# EAGLE design FREZZbigV02 (EAGLE 7.5.0)
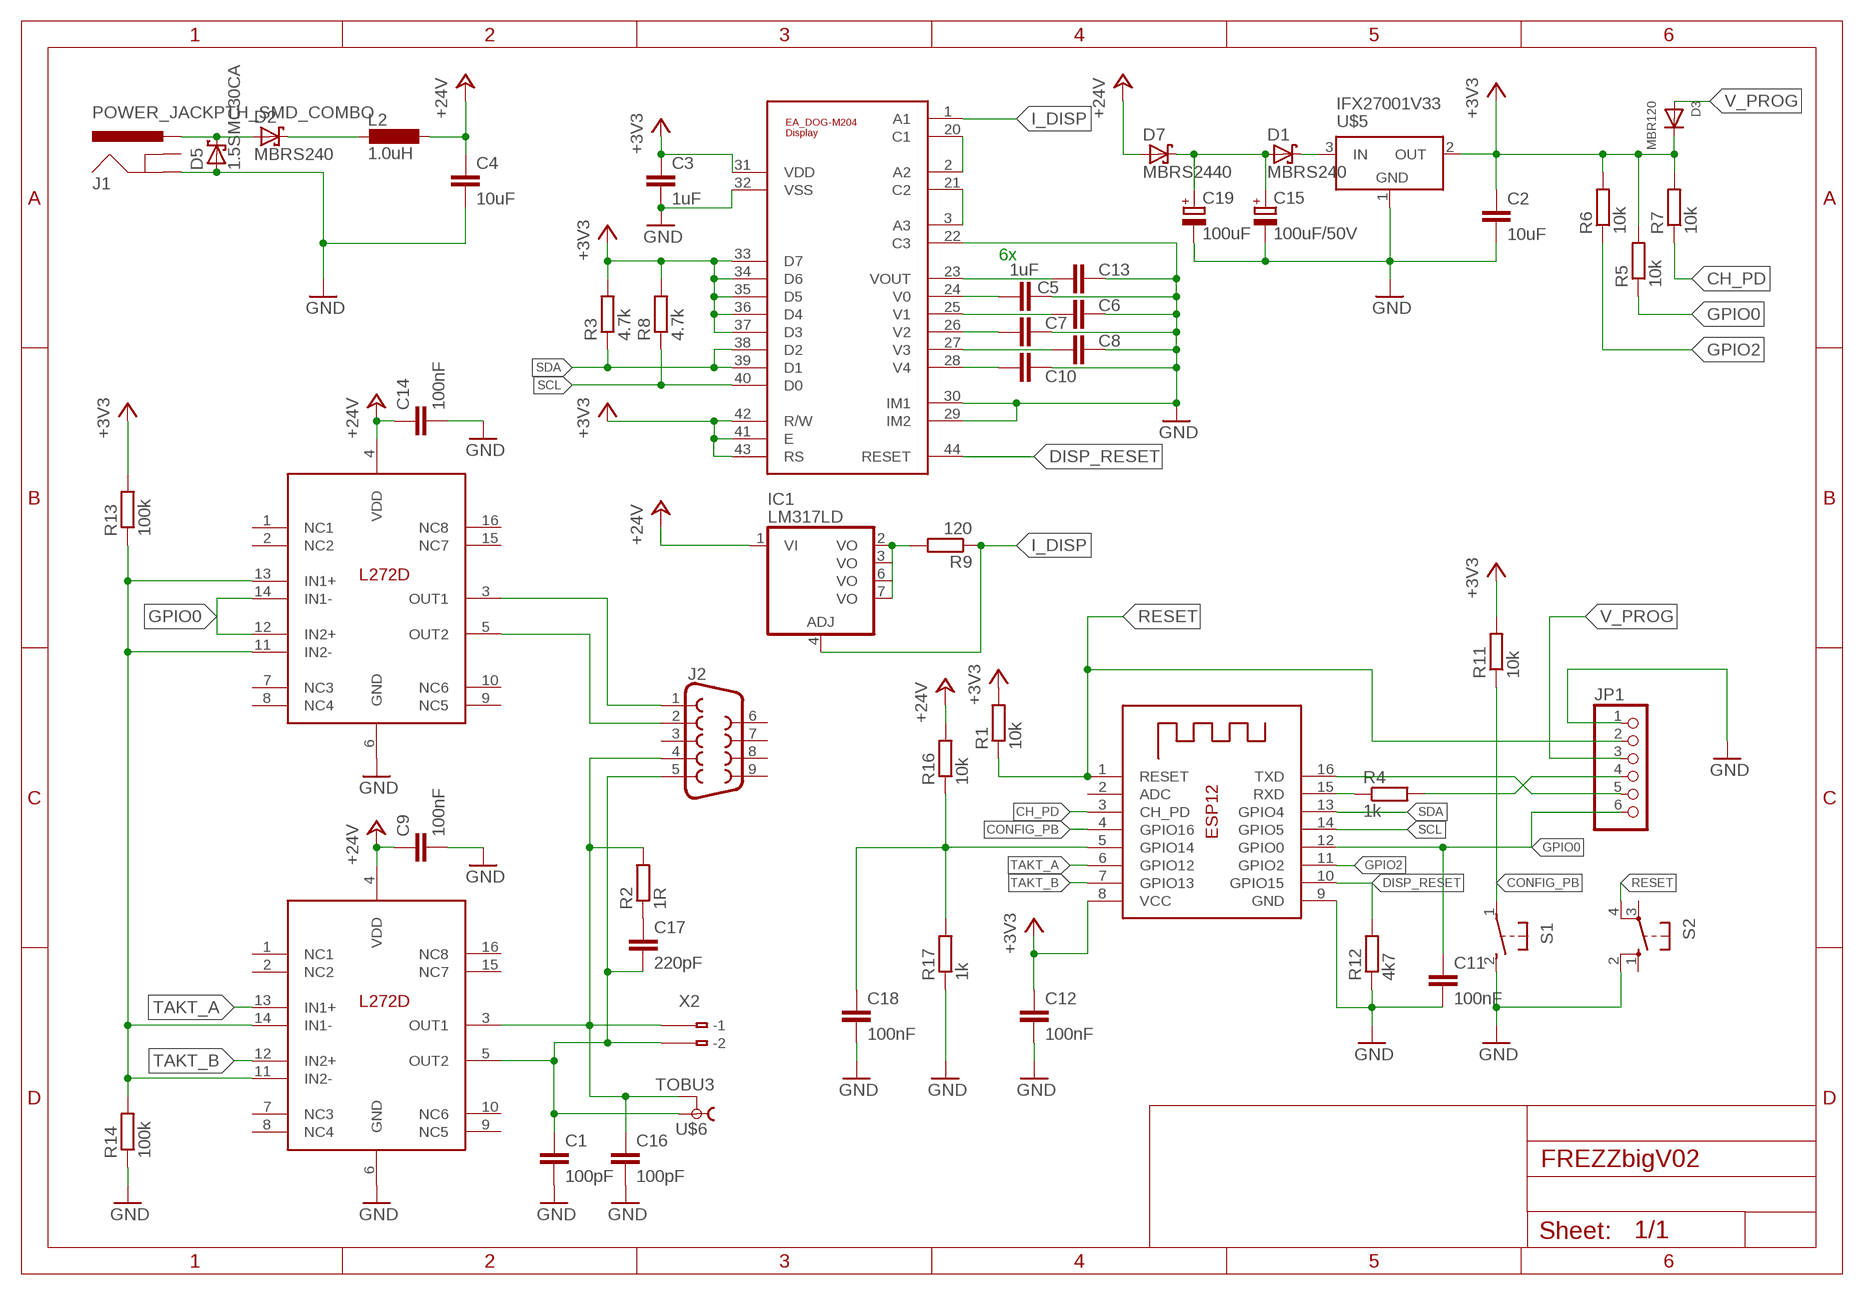
[diagram p0: schematic, sheet 1]

## Parts
C1  100pF  C-EUC0603K  [C0603K]
C2  10uF  C-EUC0603K  [C0603K]
C3  1uF  C-EUC0603K  [C0603K]
C4  10uF  C-EUC1210K  [C1210K]
C5  1uF  C-EUC0603K  [C0603K]
C6  1uF  C-EUC0603K  [C0603K]
C7  1uF  C-EUC0603K  [C0603K]
C8  1uF  C-EUC0603K  [C0603K]
C9  100nF  C-EUC0603K  [C0603K]
C10  1uF  C-EUC0603K  [C0603K]
C11  100nF  C-EUC0603K  [C0603K]
C12  100nF  C-EUC0603K  [C0603K]
C13  1uF  C-EUC0603K  [C0603K]
C14  100nF  C-EUC0603K  [C0603K]
C15  100uF/50V  CPOL-EUF  [PANASONIC_F]
C16  100pF  C-EUC0603K  [C0603K]
C17  220pF  C-EUC0603K  [C0603K]
C18  100nF  C-EUC0603K  [C0603K]
C19  100uF  CPOL-EUE7.5-18  [E7,5-18]
D1  MBRS240  SCHOTTKY-DIODESMD  [SMB]
D2  MBRS240  SCHOTTKY-DIODESMD  [SMB]
D3  MBR120  DIODESOD-123  [SOD-123]
D5  1.5SMC30CA  SCHOTTKY-DIODESMC  [SMC]
D7  MBRS2440  SCHOTTKY-DIODESMD  [SMB]
IC1  LM317LD  [SO08]
J1  POWER_JACKPTH_SMD_COMBO  [POWER_JACK_COMBO]
J2  DB9FEMALE  [DB9]
JP1  PINHD-1X6  [1X06]
L2  1.0uH  L-EUL3230M  [L3230M]
R1  10k  R-EU_M1206  [M1206]
R2  1R  R-EU_M1206  [M1206]
R3  4.7k  R-EU_M1206  [M1206]
R4  1k  R-EU_M1206  [M1206]
R5  10k  R-EU_M1206  [M1206]
R6  10k  R-EU_M1206  [M1206]
R7  10k  R-EU_M1206  [M1206]
R8  4.7k  R-EU_M1206  [M1206]
R9  120  R-EU_M1206  [M1206]
R11  10k  R-EU_M1206  [M1206]
R12  4k7  R-EU_M1206  [M1206]
R13  100k  R-EU_M1206  [M1206]
R14  100k  R-EU_M1206  [M1206]
R16  10k  R-EU_M1206  [M1206]
R17  1k  R-EU_M1206  [M1206]
S1  31-XX  [B3F-31XX]
S2  10-XX  [B3F-10XX]
U$1  EA_DOG-M204-DISPLAY  [E_DOG-M204_DISPLAY]
U$2  L272D  [SO16]
U$3  L272D  [SO16]
U$5  IFX27001V33  IFX27001  [TO252]
U$6  TOBU3  TOBU3-REICHELT  [TOBU3-REICHELT]
X1  ESP-12  [ESP-12]
X2  233-102  [233-102]

## Nets
$N122: D1.C U$5.3(IN)
+3V3 [Power]: C2.1 C3.1 C12.1 D3.C R1.2 R3.2 R5.2 R6.2 R7.2 R8.2 R11.2 R13.2 U$1.31(VDD) U$1.33(D7) U$1.34(D6) U$1.35(D5) U$1.36(D4) U$1.37(D3) U$1.41(E) U$1.42(R/W) U$1.43(RS) U$5.2(OUT) X1.8(VCC)
+24V [Power]: C4.1 C9.1 C14.1 D7.A IC1.1(VI) L2.1 R16.2 U$2.4(VDD) U$3.4(VDD)
CH_PD: R7.1 X1.3(CH_PD)
CONFIG_PB: R11.1 S1.1(P) X1.4(GPIO16)
DISP_RESET: R12.2 U$1.44(RESET) X1.10(GPIO15)
GND [Power]: C1.2 C2.2 C3.2 C4.2 C5.1 C6.1 C7.1 C8.1 C9.2 C10.1 C11.2 C12.2 C13.1 C14.2 C15.- C16.2 C18.2 C19.- D5.A J1.GND@1(GND) JP1.1 R12.1 R14.1 R17.1 S1.2(S) S2.2(S1) U$1.22(C3) U$1.29(IM2) U$1.30(IM1) U$1.32(VSS) U$2.6(GND) U$3.6(GND) U$5.1(GND) X1.9(GND)
GPIO0: C11.1 JP1.6 R5.1 U$3.12(IN2+) U$3.14(IN1-) X1.12(GPIO0)
GPIO2: R6.1 X1.11(GPIO2)
I_DISP: IC1.4(ADJ) R9.1 U$1.1(A1)
N$1: JP1.5 X1.16(TXD)
N$2: JP1.4 R4.2
N$3: R4.1 X1.15(RXD)
N$4: C13.2 U$1.23(VOUT)
N$5 [Power]: D2.A D5.C J1.POWER(PWR)
N$6: C5.2 U$1.24(V0)
N$7 [Power]: D2.C L2.2
N$8 [Power]: C15.+ C19.+ D1.A D7.C
N$9: C17.1 R2.1
N$11 [Power]: C16.1 J2.4 R2.2 U$2.3(OUT1) U$6.2 U$6.2@1 U$6.2@2 X2.B1(B-1)
N$12: C6.2 U$1.25(V1)
N$13 [Power]: C1.1 C17.2 J2.5 U$2.5(OUT2) U$6.1 X2.B2(B-2)
N$15: C7.2 U$1.26(V2)
N$16: C8.2 U$1.27(V3)
N$21: C10.2 U$1.28(V4)
N$22: U$1.3(A3) U$1.21(C2)
N$23: U$1.2(A2) U$1.20(C1)
N$24: IC1.2(VO) IC1.3(VO) IC1.6(VO) IC1.7(VO) R9.2
N$26 [Power]: J2.1 U$3.3(OUT1)
N$27 [Power]: J2.2 U$3.5(OUT2)
N$38: R13.1 R14.2 U$2.11(IN2-) U$2.14(IN1-) U$3.11(IN2-) U$3.13(IN1+)
RESET: JP1.2 R1.1 S2.4(P1) X1.1(RESET)
SCL: R8.1 U$1.40(D0) X1.14(GPIO5)
SDA: R3.1 U$1.38(D2) U$1.39(D1) X1.13(GPIO4)
SHDN: C18.1 R16.1 R17.2 X1.5(GPIO14)
TAKT_A: U$2.13(IN1+) X1.6(GPIO12)
TAKT_B: U$2.12(IN2+) X1.7(GPIO13)
V_PROG: D3.A JP1.3
Unconnected: J1.GND(GNDBREAK) J2.3 J2.6 J2.7 J2.8 J2.9 S2.1(S) S2.3(P) U$2.1(NC1) U$2.2(NC2) U$2.7(NC3) U$2.8(NC4) U$2.9(NC5) U$2.10(NC6) U$2.15(NC7) U$2.16(NC8) U$3.1(NC1) U$3.2(NC2) U$3.7(NC3) U$3.8(NC4) U$3.9(NC5) U$3.10(NC6) U$3.15(NC7) U$3.16(NC8) X1.2(ADC) X2.A1(-1) X2.A2(-2)

## Notes on the sheet
- 6x

## Library data of the parts
C1-C14 C16-C18 = rcl:C-EU: CAPACITOR, European symbol
C15 C19 = rcl:CPOL-EU: POLARIZED CAPACITOR, European symbol
D1 D2 D5 D7 = diode:SCHOTTKY-DIODE: Schottky Diode
D3 = adafruit:DIODE: Diode SMADIODE - SMA Surface Mount Package 20V 1A Schottky Diode Digikey: 641-1014-6-ND DO-1N4148 - Through Hole Small Current Diode SOD-123 20V 1 A (.5mV Vf) Schottky Diode - Digikey: MBRX120TPMSCT-ND SOD-323 10V 570mA (.38mV Vf, 3ns) Schottky Diode - Digikey: ZLLS410CT-ND SOD-523 30V 30mA Schottky Diode (RB751S-40TE61) - Digikey: RB751S-40TE61CT-ND SOT23-R/W - SOT23 Package (R = Solder Paste/Reflow Ovens, W = Hand-Soldering) BAT54Film 40V 300mA - Digikey: 497-7162-1-ND
IC1 = linear:LM317LD: LOW CURRENT 1.2 TO 37V ADJUSTABLE VOLTAGE REGULATOR Source: http://pdf.alldatasheet.com
J1 = SparkFun-Connectors:POWER_JACK: Power Jack Connector This is the standard 5.5mm barrel jack for power. The PTH is the most common, proven, reliable, footprint. The Slot footprint only works if the mill layer is transmitted to the PCB fab house so be warned. Here are the connectors we sell at SparkFun: DC Barrel Power Jack/Connector <https://www.sparkfun.com/products/119> (PRT-00119) DC Barrel Power Jack/Connector (SMD) <https://www.sparkfun.com/products/12748> (PRT-12748) DC Barrel Jack Adapter - Breadboard Compatible <https://www.sparkfun.com/products/10811> (PRT-10811) It is used on this SparkFun product (and many, many others): SparkFun RedBoard - Programmed with Arduino <https://www.sparkfun.com/products/12757> (DEV-12757) Also, if you need a mating power supply or connector, please check these out: Wall Adapter Power Supply - 9VDC 650mA <https://www.sparkfun.com/products/298> (TOL-00298) DC Barrel Jack Adapter - Male <https://www.sparkfun.com/products/10287> (PRT-10287)
J2 = SparkFun-Connectors:DB9: DB9 Connector Standard DB9 (D-Sub 9) serial connector. Can be used for CAN bus as well as RS485 and RS232. Footprint production proven. Here is the female version connector we sell at SparkFun: 9 Pin Female Serial Connector - PCB Mount <https://www.sparkfun.com/products/429> (PRT-00429) This connector has been used on the following SparkFun products: SparkFun RS232 Shifter - SMD <https://www.sparkfun.com/products/449> (PRT-00449) SparkFun RS232 Shifter SMD (No DB9) <https://www.sparkfun.com/products/8780> (PRT-08780); PROD_ID: CONN-08194
JP1 = adafruit:PINHD-1X6: PIN HEADER
L2 = rcl:L-EU: INDUCTOR, European symbol
R1-R9 R11-R14 R16 R17 = resistor:R-EU_: RESISTOR, European symbol
S1 = switch-omron:31-XX: OMRON SWITCH; MPN: B3F-3100; OC_FARNELL: 959704; OC_NEWARK: 36M3582
S2 = switch-omron:10-XX: OMRON SWITCH; MPN: B3F-1000; OC_FARNELL: 176432; OC_NEWARK: 36M3542
U$1 = display_ea_dog-m:EA_DOG-M204-DISPLAY
U$2 U$3 = adafruit:L272D
U$5 = MeineLIB:IFX27001
U$6 = con-hirschmann:TOBU3-REICHELT
X1 = adafruit:ESP-12
X2 = con-wago:233-102: WAGO Cage Clamp; MPN: 233-102; OC_FARNELL: unknown; OC_NEWARK: 28K9044

## Net classes
0 default: width 0.102 mm, drill 0.076 mm, clearance 0.051 mm
1 Power: width 1.016 mm, drill 0.076 mm, clearance 0.051 mm to class 0, clearance 0.051 mm
2 24V: width 0.127 mm, drill 0.076 mm, clearance 0.051 mm to class 0, clearance 0.051 mm to class 1, clearance 0.051 mm

## Board
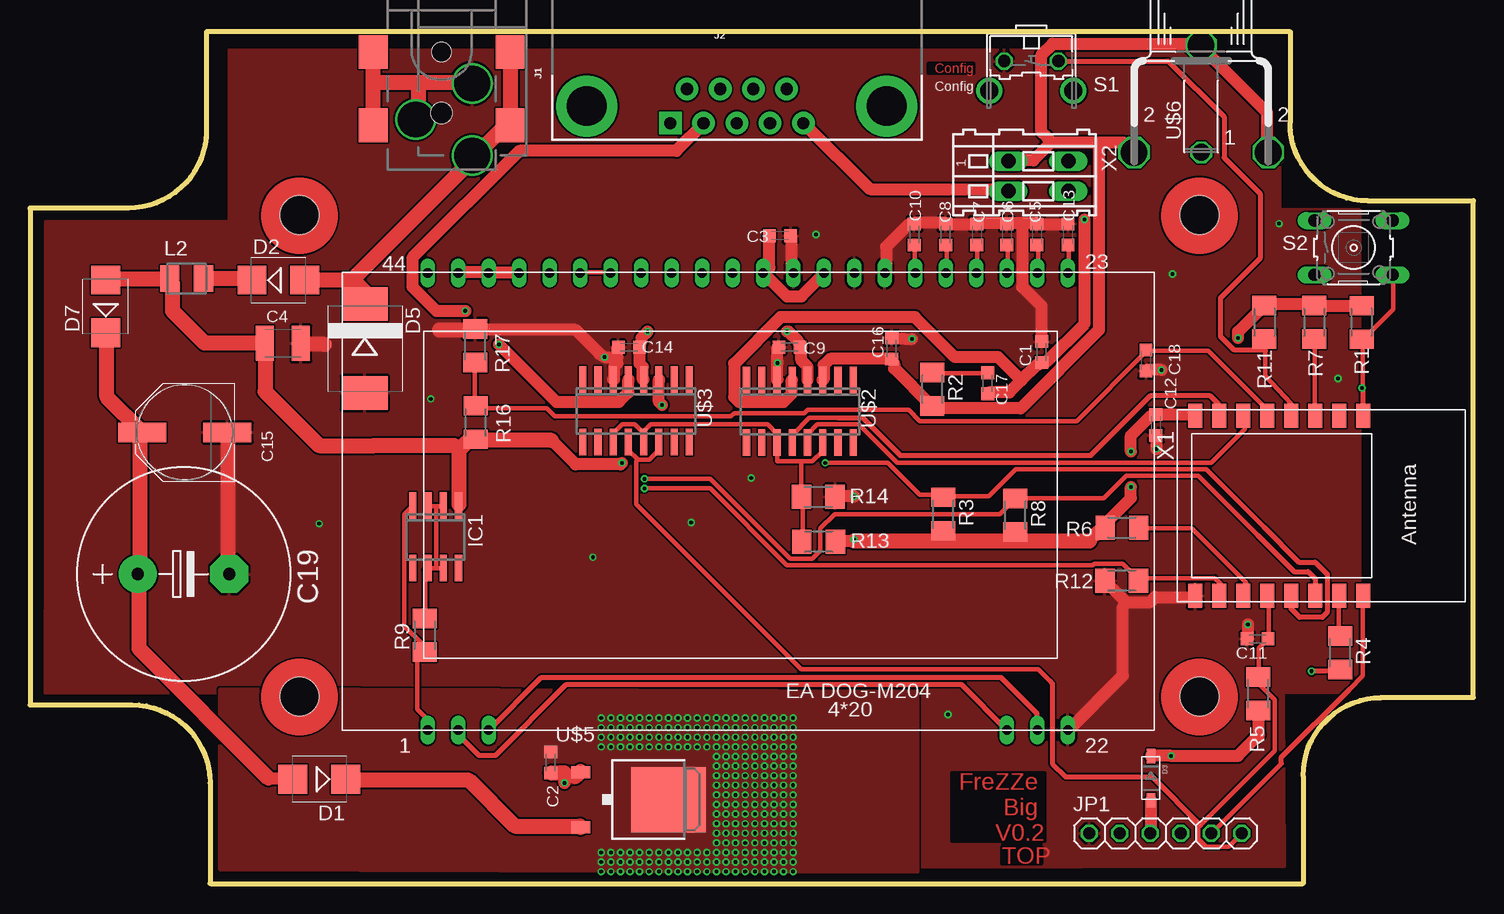
[diagram p1: board, top side]
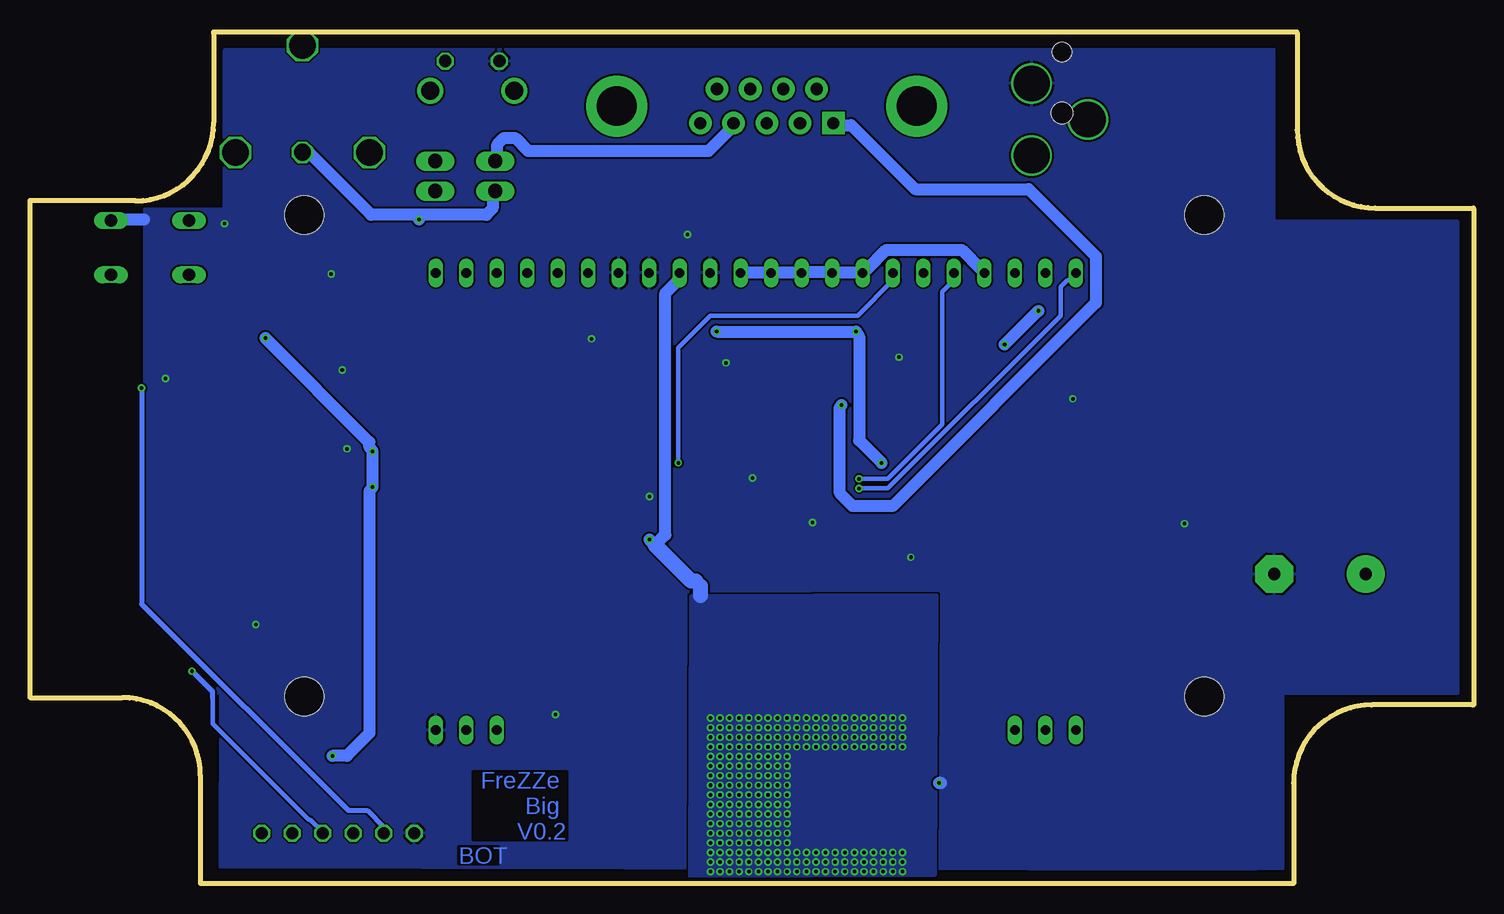
[diagram p2: board, bottom side, seen from below]

Size 120.3 x 70.98 mm. Coordinates in mm from the lower left corner, seen from the top.
Outline: 0,56.25 0,14.88
Outline: 15.05,0 106.08,0
Outline: 120.28,15.49 120.28,56.93
Outline: 105.02,70.98 14.7,70.98
Outline: 14.7,70.9 14.7,62.8 arc-90 8.2,56.3 0,56.3
Outline: 105,70.9 105,63.4 arc90 111.5,56.9 120.3,56.9
Outline: 120.3,15.5 112.6,15.5 arc90 106.1,9 106.1,0
Outline: 0.1,14.9 8.5,14.9 arc-90 15,8.4 15,0
Copper layers (1+16): Top 0.035mm / dielectric 0.36mm / Bottom 0.035mm
Design rules "PCB-Joker-Eagle-DRU-v1-0 3 *": minimum track width 15mil, minimum drill 0.3mm, track to track 6mil, track to pad 6mil, pad to pad 6mil, via to via 6mil, smd to smd 6mil, copper to edge 0mil, drill to drill 10mil, minimum pad ring 8mil, minimum via ring 6mil, stop-mask expansion 3mil, vias tented up to drill 0mil, thermal gap 8mil
Holes 3.2 mm at 97.45,15.61 97.45,55.71 22.45,55.71 22.45,15.61
tKeepout: area 112.4,22.4 to 120.1,40.6
bKeepout: area 112.4,22.4 to 120.1,40.6; area 96.2,14.3 to 98.7,16.8; area 96.2,54.4 to 98.7,56.9; area 21.2,54.4 to 23.7,56.9; area 21.2,14.3 to 23.7,16.8

### Footprints (pad centres in the part's own frame; a part is rotated, then mirrored left to right if it is on the bottom)
C0603K = smd 1.05 x 1.08: 1 -0.875,0; 2 0.875,0
C1210K = smd 1.5 x 2.9: 1 -1.5,0; 2 1.5,0
PANASONIC_F = smd 4 x 1.6: + 3.55,0; - -3.55,0
E7,5-18 = drill 1.016 pad 3.15: + -3.81,0 | drill 1.016 pad 3.15 octagon: - 3.81,0
SMB = smd 2.4 x 2.4: A 2.2,0; C -2.2,0
SOD-123 = smd 1.2 x 0.7: A 1.85,0; C -1.85,0
SMC = smd 2.8 x 3.8: A 3.7,0; C -3.7,0
SO08 = smd 0.6 x 2.2: 1 -1.905,-2.6; 2 -0.635,-2.6; 3 0.635,-2.6; 4 1.905,-2.6; 5 1.905,2.6; 6 0.635,2.6; 7 -0.635,2.6; 8 -1.905,2.6
POWER_JACK_COMBO = drill 2.997: GND 5.62,-2.16; GND@1 2.62,2.54; POWER 8.62,2.54 | smd 2.8 x 2.4: GND@3 0,-5.7; GND@4 6.1,-5.7; POWER@1 0,5.7; POWER@2 6.1,5.7 | hole 1.6: 0,0 | hole 1.8: 5.08,0
DB9 = drill 1.016 pad 1.88 square: 1 -5.54,-1.42 | drill 1.016 pad 1.88: 2 -2.77,-1.42; 3 0,-1.42; 4 2.77,-1.42; 5 5.54,-1.42; 6 -4.15,1.42; 7 -1.38,1.42; 8 1.38,1.42; 9 4.15,1.42 | drill 3.302 pad 5.08: G1 -12.5,0; G2 12.5,0
1X06 = drill 1.016 octagon: 1 -6.35,0; 2 -3.81,0; 3 -1.27,0; 4 1.27,0; 5 3.81,0; 6 6.35,0
L3230M = smd 1.6 x 2.2: 1 -1.4,0; 2 1.4,0
M1206 = smd 1.6 x 2: 1 -1.4,0; 2 1.4,0
B3F-31XX = drill 1.016 octagon: 1 -2.261,-1.245; 2 2.261,-1.245 | drill 1.499 pad 2.159: 3 -3.505,1.245; 4 3.505,1.245
B3F-10XX = drill 1.016 long: 1 -3.251,2.261; 2 3.251,2.261; 3 -3.251,-2.261; 4 3.251,-2.261
E_DOG-M204_DISPLAY = drill 0.8 long: 1 7.144,0; 2 9.684,0; 3 12.224,0; 20 55.404,0; 21 57.944,0; 22 60.484,0; 23 60.484,38.1; 24 57.944,38.1; 25 55.404,38.1; 26 52.864,38.1; 27 50.324,38.1; 28 47.784,38.1; 29 45.244,38.1; 30 42.704,38.1; 31 40.164,38.1; 32 37.624,38.1; 33 35.084,38.1; 34 32.544,38.1; 35 30.004,38.1; 36 27.464,38.1; 37 24.924,38.1; 38 22.384,38.1; 39 19.844,38.1; 40 17.304,38.1; 41 14.764,38.1; 42 12.224,38.1; 43 9.684,38.1; 44 7.144,38.1
SO16 = smd 0.6 x 2.2: 1 -4.445,-2.6; 2 -3.175,-2.6; 3 -1.905,-2.6; 4 -0.635,-2.6; 5 0.635,-2.6; 6 1.905,-2.6; 7 3.175,-2.6; 8 4.445,-2.6; 9 4.445,2.6; 10 3.175,2.6; 11 1.905,2.6; 12 0.635,2.6; 13 -0.635,2.6; 14 -1.905,2.6; 15 -3.175,2.6; 16 -4.445,2.6
TO252 = smd 1 x 1.6: 1 -2.28,-4.8; 3 2.28,-4.8 | smd 5.4 x 6.2: 2 0,2.5
TOBU3-REICHELT = drill 1.397 octagon: 1 0,-3.81 | drill 2.21 octagon: 2 5.588,-3.81; 2@1 -5.588,-3.81; 2@2 0,5.08
ESP-12 = smd 2 x 1.2: 1 -7.5,4.5; 2 -7.5,2.5; 3 -7.5,0.5; 4 -7.5,-1.5; 5 -7.5,-3.5; 6 -7.5,-5.5; 7 -7.5,-7.5; 8 -7.5,-9.5; 9 7.5,-9.5; 10 7.5,-7.5; 11 7.5,-5.5; 12 7.5,-3.5; 13 7.5,-1.5; 14 7.5,0.5; 15 7.5,2.5; 16 7.5,4.5
233-102 = drill 1.2 long: A1 -1.25,2.5; A2 1.25,2.5; B1 -1.25,-2.5; B2 1.25,-2.5

### Placement (x,y rotation side)
C1  84.3,44.3 90 top
C2  43.38,10.08 270 top
C3  62.5,54 0 top
C4  21.07,45.02 0 top
C5  83.9,54.1 270 top
C6  81.4,54.1 270 top
C7  78.9,54.1 270 top
C8  76.3,54.1 270 top
C9  63.28,44.7 180 top
C10  73.7,54.1 270 top
C11  102.3,20.4 180 top
C12  93.83,38.23 270 top
C13  86.5,54.1 270 top
C14  49.9,44.7 180 top
C15  12.9,37.6 180 top
C16  71.8,44.6 90 top
C17  79.8,41.7 270 top
C18  93,43.6 270 top
C19  12.8,25.8 0 top
D1  24.1,8.7 180 top
D2  20.7,50.3 0 top
D3  93.4,8.8 270 top
D5  27.9,44.6 270 top
D7  6.3,48.1 90 top
IC1  33.8,28.9 180 top
J1  34.3,69.3 270 top
J2  58.9,64.8 0 top
JP1  94.62,4.19 0 top
L2  13.05,50.42 0 top
R1  110.96,46.77 90 top
R2  75.2,41.2 270 top
R3  76.1,30.8 270 top
R4  109.18,19.24 270 top
R5  102.35,15.82 270 top
R6  91,29.67 180 top
R7  107.02,46.78 90 top
R8  82.1,30.7 270 top
R9  32.9,20.7 90 top
R11  102.87,46.78 90 top
R12  90.98,25.25 0 top
R13  65.72,28.5 0 top
R14  65.69,32.23 180 top
R16  37.13,38.43 270 top
R17  37.1,44.83 270 top
S1  83.44,67.31 180 top
S2  110.3,53 0 top
U$1  26,12.8 0 top
U$2  64.15,39.36 180 top
U$3  50.5,39.4 180 top
U$5  50.7,7 270 top
U$6  97.6,64.75 0 top
X1  106.6,31.5 270 top
X2  84.03,58.97 270 top

### Tracks (layer width: path | path; a pad name or v marks a point on that pad's centre or on a via)
$N122
  Top 0.381: 26.4,8.67 D1.C
  Top 1.016: 45.82,4.8 U$5.3 | 26.4,8.6 D1.C
  Top 1.27: 45.88,4.7 U$5.3 | 45.82,4.8 40.4,4.8 36.6,8.6 26.4,8.6
+3V3  (via drill 0.3)
  Top 1.016: X1.8 97.08,39.07 93.88,39.07 C12.1 93.34,38.94 91.75,37.34 v91.75,36.01 | 89.34,29.47 89.48,29.6 R6.2 89.75,30.14 91.75,32.14 v91.75,33.07 | 88.94,29.2 88.28,28.54 | R13.2 67.21,28.54 68.67,28.54 v68.67,28.67 | R1.2 107.03,48.17 R7.2 106.95,48.27 102.95,48.27 R11.2 102.55,47.87 100.68,46.01 v100.68,45.47 | R8.2 82.14,29.2 82.14,28.54 | 76.14,28.54 76.14,29.34 R3.2 | U$1.43 35.74,50.94 38.14,50.94 U$1.42 38.67,50.94 40.67,50.94 U$1.41 | C3.1 61.61,53.87 61.61,51.34 61.21,50.94 U$1.33 61.47,50.54 63.08,48.94 64.28,48.94 66.14,50.81 U$1.31 | R5.2 102.4,14.37 102.4,12.4 100.65,10.65 v95.1,10.65 D3.C
  Top 1.27: 88.28,28.54 82.14,28.54 76.14,28.54 68.67,28.54 | 88.94,29.2 R6.2
  Bottom 1.016: v68.67,28.67 68.21,28.2 67.34,29.07 67.34,49.21 66.14,50.41 66.14,50.81 U$1.31 | 64.41,24.8 64.81,25.2 | 64.41,24 64.41,23.9 | U$1.33 60.54,50.94 58.67,50.94 U$1.34 58.54,50.94 56.54,50.94 U$1.35 55.87,50.94 53.47,50.94 U$1.36 53.34,50.94 50.94,50.94 U$1.37 50.54,51.21 48.94,52.81 42.67,52.81 41.07,51.21 U$1.41 | v100.68,45.47 92.01,36.8 92.01,36.41 v91.75,36.01 v91.75,33.07 92.01,32.67 92.01,12.54 93.9,10.65 v95.1,10.65
  Bottom 1.27: 68.21,28.2 65.21,25.2 64.81,25.2 | 64.41,24 64.41,24.8
  other vias: 57.2,11.4 57.2,9.8 57.2,9 57.2,10.6 56.4,11.4 55.6,11.4 55.6,12.2 56.4,12.2 57.2,12.2 54.8,11.4 54,11.4 53.2,11.4 53.2,12.2 54,12.2 54.8,12.2 52.4,11.4 51.6,11.4 50.8,11.4 50.8,12.2 51.6,12.2 52.4,12.2 50,11.4 49.2,11.4 48.4,11.4 48.4,12.2 49.2,12.2 50,12.2 47.6,11.4 47.6,12.2 47.6,13 47.6,13.8 50,13 49.2,13 48.4,13 48.4,13.8 49.2,13.8 50,13.8 52.4,13 51.6,13 50.8,13 50.8,13.8 51.6,13.8 52.4,13.8 54.8,13 54,13 53.2,13 53.2,13.8 54,13.8 54.8,13.8 57.2,13 56.4,13 55.6,13 55.6,13.8 56.4,13.8 57.2,13.8 58.8,13.8 58.8,13 58.8,12.2 58,12.2 58,13 58,13.8 58,5.8 58,5 58,4.2 57.2,4.2 57.2,5 57.2,5.8 57.2,3.4 57.2,2.6 58,3.4 58,9 58.8,9 58.8,8.2 58.8,7.4 58.8,6.6 58.8,5.8 58.8,5 58.8,4.2 58.8,3.4 58.8,2.6 58,2.6 58,1.8 57.2,1.8 58.8,1.8 58.8,11.4 58.8,10.6 58.8,9.8 58,9.8 58,10.6 58,11.4 58,8.2 58,7.4 58,6.6 57.2,6.6 57.2,7.4 57.2,8.2 56.4,1.8 55.6,1.8 54.8,1.8 54.8,2.6 55.6,2.6 56.4,2.6 54,1.8 53.2,1.8 52.4,1.8 52.4,2.6 53.2,2.6 54,2.6 51.6,1.8 50.8,1.8 50,1.8 50,2.6 50.8,2.6 51.6,2.6 49.2,1.8 48.4,1.8 47.6,1.8 47.6,2.6 48.4,2.6 49.2,2.6 58,1 57.2,1 58.8,1 56.4,1 55.6,1 54.8,1 54,1 53.2,1 52.4,1 51.6,1 50.8,1 50,1 49.2,1 48.4,1 47.6,1 59.6,11.4 59.6,9.8 59.6,9 59.6,10.6 59.6,12.2 59.6,13 59.6,13.8 61.2,13.8 61.2,13 61.2,12.2 60.4,12.2 60.4,13 60.4,13.8 60.4,5.8 60.4,5 60.4,4.2 59.6,4.2 59.6,5 59.6,5.8 59.6,3.4 59.6,2.6 60.4,3.4 60.4,9 61.2,9 61.2,8.2 61.2,7.4 61.2,6.6 61.2,5.8 61.2,5 61.2,4.2 61.2,3.4 61.2,2.6 60.4,2.6 60.4,1.8 59.6,1.8 61.2,1.8 61.2,11.4 61.2,10.6 61.2,9.8 60.4,9.8 60.4,10.6 60.4,11.4 60.4,8.2 60.4,7.4 60.4,6.6 59.6,6.6 59.6,7.4 59.6,8.2 60.4,1 59.6,1 61.2,1 62,11.4 62,9.8 62,9 62,10.6 62,12.2 62,13 62,13.8 63.6,13.8 63.6,13 63.6,12.2 62.8,12.2 62.8,13 62.8,13.8 62.8,5.8 62.8,5 62.8,4.2 62,4.2 62,5 62,5.8 62,3.4 62,2.6 62.8,3.4 62.8,9 63.6,9 63.6,8.2 63.6,7.4 63.6,6.6 63.6,5.8 63.6,5 63.6,4.2 63.6,3.4 63.6,2.6 62.8,2.6 62.8,1.8 62,1.8 63.6,1.8 63.6,11.4 63.6,10.6 63.6,9.8 62.8,9.8 62.8,10.6 62.8,11.4 62.8,8.2 62.8,7.4 62.8,6.6 62,6.6 62,7.4 62,8.2 62.8,1 62,1 63.6,1
  pour Bottom (no thermals): 44.8,24 65.2,23.9 65.3,0.7 44.9,0.8
  pour Top (no thermals): 15.9,16.2 73.9,16 73.9,1 15.9,1.2
+24V  (via drill 0.3)
  Top 1.016: U$2.4 64.81,42.01 64.81,43.07 64.28,43.6 64.28,44.67 C9.1 64.01,45.21 63.21,46.01 v63.08,46.01 | U$3.4 51.07,42.01 51.07,43.07 50.81,43.34 50.81,44.67 C14.1 50.94,45.21 50.94,45.47 v51.47,46.01 | 35.74,31.6 IC1.1 | 36.41,36.8 R16.2 37.6,36.94 | 43.47,36.94 45.47,34.94 49.21,34.94 v49.34,35.07 | 35.34,36.51 35.74,36.14 | 11.6,50.41 L2.1 11.87,50.01 | 6.4,50.41 D7.A | 19.47,45.07 C4.1 19.67,44.07 | 28.47,36.47 28.67,36.51
  Top 1.27: 35.74,31.6 35.74,36.14 36.41,36.8 | 43.47,36.94 37.6,36.94 | 35.34,36.51 28.67,36.51 24.09,36.51 19.6,41 19.6,44 19.67,44.07 | 6.4,50.41 11.6,50.41 | 19.47,45.07 14.53,45.07 11.87,47.73 11.87,50.01
  Bottom 1.016: v63.08,46.01 v51.47,46.01 51.21,45.61 51.21,36.94 v49.34,35.07
CH_PD
  Top 0.381: R7.1 107.08,45.34 107.08,39.07 X1.3
CONFIG_PB
  Top 0.381: R11.1 102.95,45.34 102.95,44.4 102.95,42.34 105.11,39.97 X1.4
  Top 0.406: S1.1 94.85,68.55 99.5,63.9 99.5,60.5 102.5,57.5 102.5,52.1 99.2,48.8 99.2,45.6 100.3,44.5 102.85,44.5 102.95,44.4
DISP_RESET  (via drill 0.3)
  Top 0.381: X1.10 99.08,24 99.35,24.84 99.15,25.07 98.75,25.47 92.55,25.47 92.41,25.34 R12.2 92.28,25.47 91.08,26.67 88.68,26.67 88.54,26.54 63.08,26.54 56.67,32.94 v51.21,32.94
  Bottom 0.381: v51.21,32.94 48.81,32.94 34.4,47.34 34.4,49.74 33.87,50.27 33.74,50.27 33.2,50.81 U$1.44
GND  (via drill 0.3)
  Top 1.016: 62.27,43.47 62.27,42.01 U$2.6 | 62.27,43.47 62.27,44.67 C9.2 | 48.94,43.87 48.94,43.34 48.67,43.07 48.67,42.01 U$3.6 | 48.94,43.87 48.94,44.67 C14.2 | v101.48,21.6 101.48,20.4 C11.2 | v93.88,36.24 93.88,37.34 C12.2 | 48.94,43.87 v47.87,43.87 47.47,44.14 45.47,46.14 37.6,46.14 R17.1 37.07,46.14 | C16.2 73.5,45.38 v73.5,45.4 | 62.27,43.47 v62.3,43.4 | v68.67,32.27 67.21,32.27 R14.1 | v94.28,42.8 93.08,42.8 C18.2 | 45.47,8.93 44.81,8.93 44.54,8.53 v44.54,8.4 | 43.47,9.2 C2.2 | 45.87,9.34 U$5.1 | 16.54,37.47 C15.- | 16.54,25.87 C19.- | 28.94,40.94 D5.A 28.4,41.07 | 22.67,44.94 C4.2 | 91.34,23.47 93.34,23.47 93.75,23.87 97.08,23.87 X1.9 | 91.34,23.47 89.61,25.2 R12.1 | C3.2 63.48,53.87 63.48,51.07 63.61,50.94 U$1.32 | 82.68,55.07 81.88,55.07 C6.1 81.34,55.07 79.34,55.07 C7.1 78.81,54.94 76.81,54.94 C8.1 76.28,55.07 73.74,55.07 C10.1 73.21,54.94 71.34,53.07 71.34,50.94 U$1.29 | 82.68,55.07 83.88,55.07 C5.1 84.41,54.94 86.41,54.94 C13.1 | 82.68,55.07 82.68,49.74 84.28,48.14 84.28,45.21 C1.2 | 91.34,23.47 91.08,23.07 91.08,17.34 86.54,12.8 U$1.22
  Top 1.27: 43.47,9.2 44.54,9.2 44.81,8.93 | 45.87,9.34 45.47,8.93 | 16.54,25.87 16.54,37.47 | 34.14,46.14 37.07,46.14 | 24.54,44.94 22.67,44.94
  Bottom 1.016: v44.54,8.4 44.41,8.4 44.38,8.4 | 110.8,55.34 113.48,55.34 S2.2
  other vias: 55.1,30.1 60.1,33.8 46.9,27.2 24.1,30 76.5,14.1 109,42.1 104.1,55 95.2,50.8 65.5,54.1 33.4,40.4
  pour Bottom (rank 6): 16.6,69.5 104.1,69.5 104.1,69.4 104.14,69.4 104.14,56.2 110.8,56.2 110.8,15.9 104.46,15.9 104.46,15.56 104.5,1.4 20.3,1.2 15.88,1.27 15.88,15.88 1.27,15.88 1.27,22.8 1.3,22.8 1.3,55.2 16.6,55.2
  pour Top (rank 6): 16.6,69.5 104.1,69.5 104.1,69.4 104.14,69.4 104.14,56.2 110.8,56.2 110.8,15.9 104.46,15.9 104.46,15.56 104.5,1.4 20.3,1.2 15.88,1.27 15.88,15.88 1.27,15.88 1.27,22.8 1.3,22.8 1.3,55.2 16.6,55.2
GPIO0
  Top 0.381: X1.12 103.21,23.87 103.21,20.4 C11.1 103.08,20.27 102.41,19.6 102.41,17.34 R5.1 102.41,17.07 102.41,16.67 103.75,15.34 103.75,11.07 97.54,4.86 97.35,4.67 97.35,3.73 98.01,3.07 99.88,3.07 100.95,4.13 JP1.6 | 50.67,35.34 49.87,36.14 49.87,36.67 U$3.12 | 50.67,35.34 51.61,35.34 52.27,36.01 52.27,36.67 U$3.14 | 50.67,35.34 50.54,35.2 50.54,31.6 64.28,17.87 84.01,17.87 84.94,16.93
  Top 0.406: 84.94,16.93 85.2,16.68 85.2,10 86.3,8.9 93.5,8.9 97.54,4.86
GPIO2
  Top 0.381: X1.11 101.08,24 101.15,24.84 101.35,25.07 96.81,29.6 92.41,29.6 R6.1
I_DISP
  Top 0.381: IC1.4 31.87,31.47 31.2,30.8 31.2,21.47 32.8,19.87 32.8,19.47 R9.1 32.8,19.2 32.27,18.67 32.27,14.54 33.07,13.73 33.07,12.8 U$1.1
N$1
  Top 0.381: 109.75,16 109.92,16.18 111.08,17.34 111.08,23.87 X1.16 | 104.28,10 98.55,4.27 JP1.5
  Top 0.406: 104.28,10 104.28,10.54 109.92,16.18
N$2  (via drill 0.3)
  Top 0.381: 108,17.74 109.08,17.74 R4.2 | 106.81,17.74 v106.8,17.7
  Top 0.406: 106.81,17.74 108,17.74
  Bottom 0.381: 105.08,15.47 105.08,13.34 97.08,5.33 96.94,5.33 95.88,4.27 JP1.4 | 106.81,17.74 v106.8,17.7
  Bottom 0.406: 105.08,15.47 105.08,16 106.81,17.74
N$3
  Top 0.381: X1.15 109.08,23.87 109.08,20.67 R4.1
N$4
  Top 0.381: C13.2 86.54,53.21 86.54,50.94 U$1.23
N$5
  Top 1.016: 22.94,50.27 D2.A | 28.8,48.41 D5.C | 36.8,60.27 36.8,60.67 J1.POWER | 27.2,50.67 26.94,50.27
  Top 1.27: 22.94,50.27 26.94,50.27 28.8,48.41 | 36.8,60.27 27.2,50.67
N$6
  Top 0.381: C5.2 84.01,53.21 84.01,50.94 U$1.24
N$7
  Top 1.016: 14.54,50.41 L2.2 | 18.4,50.41 D2.C
  Top 1.27: 18.4,50.41 14.54,50.41
N$8
  Top 1.016: 6.4,45.87 D7.C | 9.34,37.6 C15.+ 9.2,37.2 | 19.87,8.8 21.87,8.8 D1.A | 9.07,25.74 C19.+ 9.2,26.27
  Top 1.27: 6.4,45.87 6.4,40.54 9.34,37.6 | 19.87,8.8 9.07,19.6 9.07,25.74 | 9.2,26.27 9.2,37.2
N$9
  Top 0.381: C17.1 79.74,42.54 75.21,42.54 R2.1
N$11
  Top 1.016: U$2.3 66.14,42.01 66.14,43.2 66.67,43.74 71.34,43.74 C16.1 72.01,43.34 72.01,42.94 75.08,39.87 R2.2 75.61,39.6 82.54,39.6 89.08,46.14 89.08,61.74 | U$6.2 103.08,60.94 103.08,64.28 97.61,69.74 U$6.2@2 97.21,70.01 85.21,70.01 84.28,69.08 84.28,62.67 84.81,62.14 85.08,61.74 | 85.08,61.74 83.61,60.27 81.61,60.27 X2.B1 | 89.08,61.74 91.21,61.74 U$6.2@1 | 89.08,61.74 85.08,61.74
  Bottom 1.016: J2.4 61.74,63.34 61.74,63.08 63.74,61.07 78.81,61.07 79.88,62.14 80.81,62.14 81.34,61.61 81.34,60.41 81.48,60.27 X2.B1
N$12
  Top 0.381: C6.2 81.48,53.21 81.48,50.94 U$1.25
N$13  (via drill 0.3)
  Top 1.016: 82.61,41.94 83.88,43.2 C1.1 84.68,43.47 87.88,46.67 v87.88,55.34 | 82.61,41.94 81.61,40.94 79.88,40.94 C17.2 | 82.61,41.94 80.68,43.87 77.08,43.87 73.74,47.21 62.54,47.21 58.67,43.34 58.67,40.54 59.07,40.14 62.81,40.14 63.48,40.8 63.48,41.87 U$2.5 | X2.B2 81.08,57.87 70.01,57.87 64.54,63.34 J2.5
  Bottom 1.016: 87.88,55.74 82.28,55.74 81.74,56.27 81.74,57.47 81.61,57.61 X2.B2 | 87.88,55.74 91.88,55.74 97.08,60.94 97.48,60.94 U$6.1 | v87.88,55.34 87.88,55.74
N$15
  Top 0.381: C7.2 78.94,53.21 78.94,50.94 U$1.26
N$16
  Top 0.381: C8.2 76.41,53.21 76.41,50.94 U$1.27
N$21
  Top 0.381: C10.2 73.74,53.21 73.74,50.94 U$1.28
N$22
  Top 0.406: U$1.3 42.62,17.2 80.9,17.2 83.9,14.2 83.9,12.84 U$1.21
N$23
  Top 0.381: 35.74,12.8 U$1.2
  Top 0.406: 35.74,12.8 35.74,12.36 37.4,10.7 38.8,10.7 44.7,16.6 77.6,16.6 U$1.20
  Bottom 0.381: 81.34,12.8 U$1.20
N$24
  Top 0.381: 33.87,31.47 34.4,31.47 IC1.2 | 33.87,31.47 33.2,31.47 IC1.3 | R9.2 32.94,22.14 32.94,26.14 33.07,26.27 IC1.6 33.34,26.27 33.87,26.27 | 33.87,26.27 34.4,26.27 IC1.7 | 33.87,26.27 33.87,31.47
N$26  (via drill 0.3)
  Top 1.016: v52.67,39.87 52.41,40.14 52.41,41.87 U$3.3
  Bottom 1.016: v52.67,39.87 52.81,39.74 52.81,32.54 51.74,31.47 48.41,31.47 31.47,48.41 31.47,52.27 37.07,57.87 46.54,57.87 51.87,63.21 53.21,63.21 53.34,63.34 J2.1
N$27  (via drill 0.3)
  Top 1.016: v39.07,44.94 43.87,40.14 49.07,40.14 49.87,40.94 49.87,41.87 U$3.5 | v36.27,47.74 33.87,47.74 31.87,49.74 31.87,52.14 40.8,61.07 53.87,61.07 56.14,63.34 J2.2
  Bottom 1.016: v36.27,47.74 v39.07,44.94
N$38
  Top 0.381: U$3.11 48.67,36.8 48.67,37.6 49.34,38.27 50.41,38.27 51.07,37.6 51.07,36.8 U$3.13 51.21,37.74 51.74,38.27 61.47,38.27 62.27,37.47 62.27,36.94 U$2.11 62.27,36.67 62.27,35.2 64.28,35.2 | 64.28,35.2 65.21,35.2 66.01,36.01 66.01,36.67 U$2.14 | R13.1 64.41,28.54 64.41,32.14 R14.2 64.28,32.4 64.28,35.2
RESET  (via drill 0.3)
  Top 0.381: R1.1 111.08,45.34 111.08,39.07 X1.1 | 110.81,45.47 R1.1 | R1.1 111.21,45.47 113.61,47.87 113.61,50.67 S2.4
  Top 0.406: X1.1 111.1,41.2 v111,41.3
  Bottom 0.406: v111,41.3 111,23.3 93.8,6.1 92.2,6.1 90.81,4.71 JP1.2
SCL  (via drill 0.3)
  Top 0.381: 107.21,24 X1.14 107.21,24.14 | 102.28,29.07 97.35,34 91.34,34 89.48,32.14 82.14,32.14 R8.1 82.01,32 80.81,30.8 67.08,30.8 65.88,29.6 65.88,27.74 65.21,27.07 63.34,27.07 56.67,33.74 v51.21,33.74 | 104.58,26.77 104.55,26.8
  Top 0.406: 102.28,29.07 104.58,26.77 105.35,26 106.5,26 107.1,25.4 X1.14
  Bottom 0.381: v51.21,33.74 48.81,33.74 44.27,38.27 44.27,49.34 43.34,50.27 43.34,50.81 U$1.40
SDA  (via drill 0.3)
  Top 0.381: U$1.39 45.87,50.94 48.27,50.94 U$1.38 | 102.81,29.74 98.01,34.54 82.14,34.54 79.88,32.27 76.14,32.27 R3.1 76.01,32.4 74.14,32.4 71.48,35.07 v66.28,35.07 | 105.21,24 X1.13
  Top 0.406: 102.81,29.74 105.75,26.8 107.1,26.8 108.1,25.8 108.1,22.6 107.7,22.2 105.8,22.2 105.1,22.9 X1.13
  Bottom 0.381: v66.28,35.07 66.28,44.67 63.61,47.34 51.34,47.34 48.41,50.27 48.41,50.81 U$1.38
SHDN
  Top 0.381: R16.1 37.07,39.87 37.07,43.34 R17.2 | X1.5 103.51,39.07 98.18,44.41 93.08,44.41 C18.1 92.94,44.27 87.21,38.54 74.14,38.54 73.21,39.47 64.81,39.47 64.54,39.2 58.67,39.2 58.41,38.94 43.74,38.94 43.07,39.6 37.34,39.6 R16.1 | 37.2,39.74 R16.1
TAKT_A
  Top 0.381: X1.6 101.08,38.94 101.25,38.2 101.25,37.87 98.44,35.07 72.28,35.07 69.08,38.27 65.61,38.27 64.81,37.47 64.81,36.8 U$2.13
TAKT_B
  Top 0.381: 67.34,38.8 64.94,38.8 63.61,37.47 63.61,36.8 U$2.12 | 99.08,39.07 X1.7
  Top 0.406: 67.34,38.8 69.39,38.8 72.5,35.7 88.4,35.7 93.4,40.7 98.3,40.7 99,40 99,39.1 X1.7
V_PROG
  Top 0.381: 93.48,4.27 JP1.3
  Top 1.016: D3.A 93.4,4.24 JP1.3
(copper drawn outside any net)
  shapes: Top circle x4

### Text on the board
Top: Config | FreZZe / Big / V0.2 | TOP
Bottom: FreZZe / Big / V0.2 | BOT
tNames: Config
200bmp: /Users/michl/Desktop/ei500.bmp